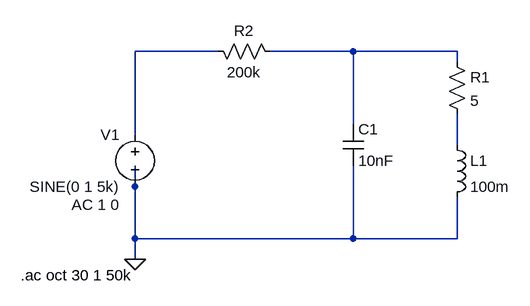
[diagram p0: schematic Lab7ZusatzRLC.asc]
Lab7ZusatzRLC.asc, the LTspice schematic file:
Version 4
SHEET 1 880 680
WIRE 208 16 80 16
WIRE 416 16 288 16
WIRE 576 16 416 16
WIRE 576 32 576 16
WIRE 416 128 416 16
WIRE 80 144 80 16
WIRE 576 160 576 112
WIRE 80 224 80 192
WIRE 80 304 80 224
WIRE 416 304 416 192
WIRE 416 304 80 304
WIRE 576 304 576 240
WIRE 576 304 416 304
WIRE 80 336 80 304
FLAG 80 336 0
SYMBOL voltage 80 128 M0
WINDOW 123 24 124 Left 2
WINDOW 39 0 0 Left 0
SYMATTR InstName V1
SYMATTR Value SINE(0 1 5k)
SYMATTR Value2 AC 1 0
SYMBOL res 560 16 R0
SYMATTR InstName R1
SYMATTR Value 5
SYMBOL ind 560 144 R0
SYMATTR InstName L1
SYMATTR Value 100m
SYMBOL cap 400 128 R0
SYMATTR InstName C1
SYMATTR Value 10nF
SYMBOL res 192 0 M90
WINDOW 0 0 56 VBottom 2
WINDOW 3 32 56 VTop 2
SYMATTR InstName R2
SYMATTR Value 200k
TEXT -96 360 Left 2 !.ac oct 30 1 50k

The netlist it stands for:
* Lab7ZusatzRLC.asc
V1 N001 0 SINE(0 1 5k) AC 1 0
R1 N002 N003 5
L1 N003 0 100m
C1 N002 0 10nF
R2 N001 N002 200k
.ac oct 30 1 50k
.backanno
.end